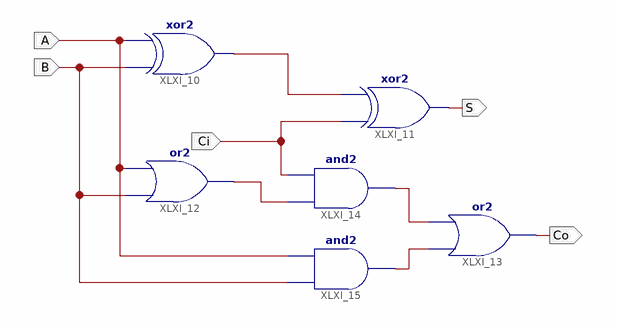
[diagram p0: schematic sheet 1]
// Xilinx ISE schematic FullAdd.sch (spartan6) as structural Verilog: 6 symbols, 5 ports
module FullAdd (
  input  Ci,
  input  A,
  input  B,
  output S,
  output Co
);

  wire XLXN_17, XLXN_19, XLXN_20, XLXN_21;

  xor XLXI_10 (XLXN_17, B, A);
  xor XLXI_11 (S, Ci, XLXN_17);
  or XLXI_12 (XLXN_21, B, A);
  or XLXI_13 (Co, XLXN_20, XLXN_19);
  and XLXI_14 (XLXN_19, XLXN_21, Ci);
  and XLXI_15 (XLXN_20, B, A);
endmodule
